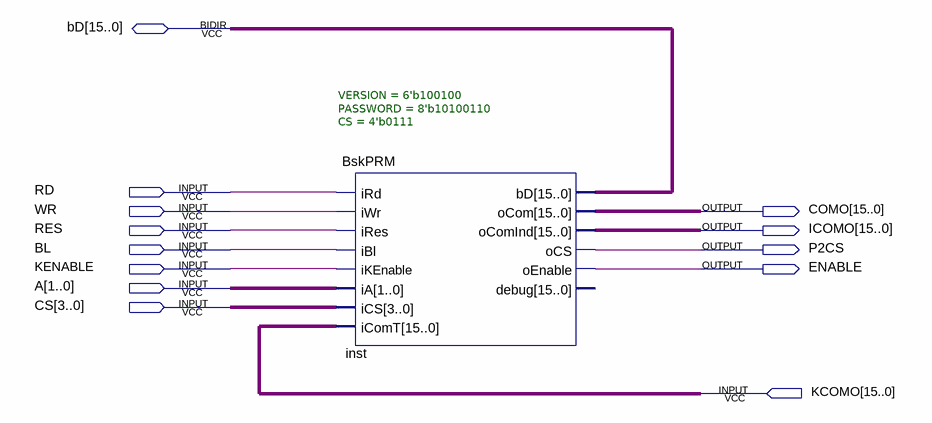
[diagram p0: schematic sheet]
// Quartus schematic Plis_Bsk_Prm_v2_04.bdf as structural Verilog: 1 symbols, 13 pins
module Plis_Bsk_Prm_v2_04 (
  input  RD,
  input  WR,
  input  RES,
  input  BL,
  input  KENABLE,
  input  [1:0] A,
  input  [3:0] CS,
  input  [15:0] KCOMO,
  inout  [15:0] bD,
  output [15:0] COMO,
  output [15:0] ICOMO,
  output P2CS,
  output ENABLE
);

  BskPRM #(.VERSION(6'b100100), .PASSWORD(8'b10100110), .CS(4'b0111)) inst (
    .iRd(RD), .iWr(WR), .iRes(RES), .iBl(BL), .iKEnable(KENABLE), .iA(A), .iCS(CS), .iComT(KCOMO),
    .oCom(COMO), .oComInd(ICOMO), .oCS(P2CS), .oEnable(ENABLE), .bD(bD));  // open: debug
endmodule
